# EasyEDA Pro project ProPrj_辉光管_2024.2.16_2024-11-09.epro, board PCB12
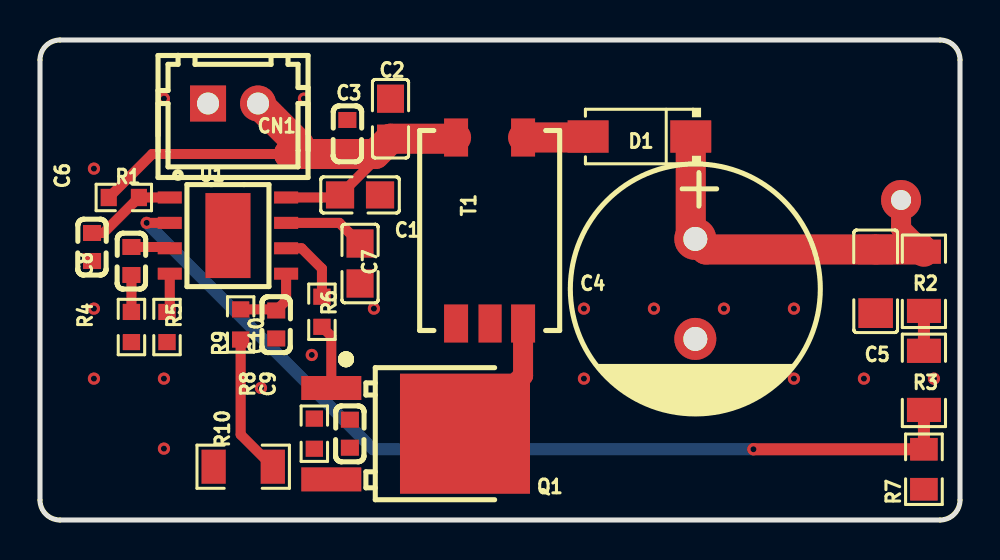
[diagram p6: board, top side]
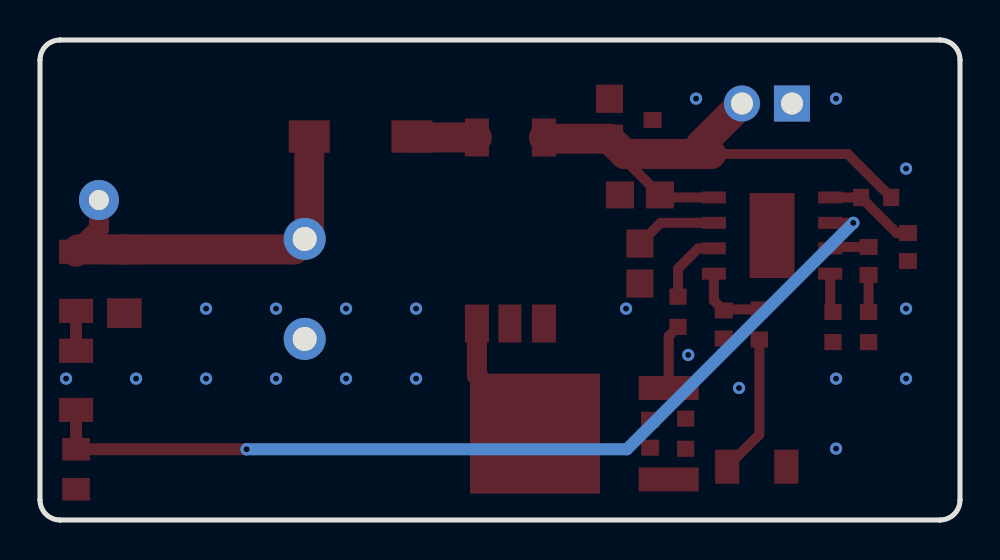
[diagram p7: board, bottom side, seen from below]

Outline 46 x 24 mm; copper layers: Top Layer, Bottom Layer. Coordinates in mm from the lower left corner of the outline.
Outline path: 0,23 0,1 arc(0.29,0.29) 1,0 45,0 arc(45.71,0.29) 46,1 46,23 arc(45.71,23.71) 45,24 1,24 arc(0.29,23.71) 0,23
Stack: Top Layer 0.035mm / Dielectric1 1.51mm FR4 er 4.5 / Bottom Layer 0.035mm

## Design rules (mm)
template: 自定义配置
spacing copperThickness1oz (default): track to track 0.102, other pairs 0.152 to 0.3
spacing copperThickness2oz: track to track 0.203, other pairs 0.152 to 0.3
track width copperThickness1oz (default): min 0.127, default 0.254, max 2.54
track width copperThickness2oz: min 0.203, default 0.254, max 2.54
differential pair differentialPair (default): width min 0.127, default 0.254, max 2.54; gap min 0.152, default 0.152
via viaSize (default): diameter min 0.5, default 0.61, max 10; hole min 0.3, default 0.305, max 6.3

## Placement (name value [footprint] x y rotation side)
C1  10uF  [C0805]  16 16.25 180 top
C2  10uF  [C0805]  17.53 20.06 270 top
C3  100nF  [C0603]  15.37 19.3 270 top
C4  47uF  [CAP-TH_BD12.5-P5.00-D0.6-FD]  32.77 11.55 270 top
C5  100nF  [C1206]  41.78 11.94 90 top
C6  100nF  [C0603]  2.6 13.65 90 top
C7  10uF  [C0805]  16 12.82 270 top
C8  10nF  [C0603]  4.57 12.95 90 top
C9  1nF  [C0603]  15.49 4.31 90 top
C10  100nF  [C0603]  11.81 9.78 90 top
CN1  ZX-XH2.54-2PZZ  [CONN-TH_2P-P2.50_HX25003-2A]  9.65 20.83 0 top
D1  ES1J  [SMA_L4.4-W2.8-LS5.4-RD]  29.97 19.17 180 top
NOREF  -  [Pad_e353]  43.05 16 0 top
Q1  NCEP02515K  [TO-252-3_L6.6-W6.1-P4.58-LS10.1-BR-2]  17.91 4.31 180 top
R1  10kΩ  [R0603]  4.19 16.13 180 top
R2  100kΩ  [R1206]  44.2 11.94 270 top
R3  100kΩ  [R1206]  44.2 6.98 270 top
R4  10kΩ  [R0603]  4.57 9.65 90 top
R5  100kΩ  [R0603]  6.35 9.65 90 top
R6  10Ω  [R0603]  14.1 10.41 270 top
R7  1.5kΩ  [R0805]  44.2 2.54 90 top
R8  10kΩ  [R0603]  13.72 4.31 90 top
R9  20Ω  [R0603]  10.03 9.78 270 top
R10  100mΩ  [R1206]  10.16 2.66 0 top
T1  TTRN-060S-013-T  [TTRN-060S-013]  22.48 14.47 0 top
U1  -  [ESOP-8_L4.9-W3.9-P1.27-LS6.0-BL-EP4.2]  9.4 14.22 270 top

## Footprints (pads in the part's own frame, mm; a bottom-side part is the same pattern mirrored in y, then rotated)
C0603
  rect 0.8x0.9 smd: 1(-0.7,0) 2(0.7,0)
C0805
  rect 1.41x1.35 smd: 1(-1,0) 2(1,0)
C1206
  rect 1.485x1.728 smd: 1(-1.593,0) 2(1.593,0)
CAP-TH_BD12.5-P5.00-D0.6-FD
  round 2.1 hole 1.2: 1(-2.5,0) 2(2.5,0)
CONN-TH_2P-P2.50_HX25003-2A
  rect 1.8x1.8 hole 1.1: 1(-1.25,0)
  round 1.8 hole 1.1: 2(1.25,0)
ESOP-8_L4.9-W3.9-P1.27-LS6.0-BL-EP4.2
  rect 0.6x1.2 smd: 1(-1.905,-2.909) 2(-0.635,-2.909) 3(0.635,-2.909) 4(1.905,-2.909) 5(1.905,2.909) 6(0.635,2.909) 7(-0.635,2.909) 8(-1.905,2.909)
  rect 4.25x2.25 smd: 9(0,0)
Pad_e353
  round 2 hole 1: 1(0,0)
R0603
  rect 0.806x0.864 smd: 1(-0.753,0) 2(0.753,0)
R0805
  rect 1.133x1.377 smd: 1(-1,0) 2(1,0)
R1206
  rect 1.208x1.701 smd: 1(-1.479,0) 2(1.479,0)
SMA_L4.4-W2.8-LS5.4-RD
  rect 2.046x1.62 smd: 1(-2.566,0) 2(2.566,0)
TO-252-3_L6.6-W6.1-P4.58-LS10.1-BR-2
  rect 3x1.2 smd: 1(3.342,-2.285) 3(3.342,2.285)
  rect 6.5x6 smd: 2(-3.342,0)
TTRN-060S-013
  rect 1.2x1.9 smd: 1(-1.675,4.65) 2(1.675,4.651) 3(-1.675,-4.65) 5(1.675,-4.651)
  rect 1.15x1.9 smd: EMPTY(0.025,-4.65)

## Nets
GND: C1.1 C2.1 C3.1 C4.2 C5.1 C6.1 C7.2 C10.1 CN1.1 R4.1 R5.1 R7.1 R10.1 T1.3 U1.9
VIN: C1.2 C2.2 C3.2 CN1.2 R1.2 T1.1 U1.8
FB: R3.2 R7.2 U1.2
HV: C4.1 C5.2 D1.1 NOREF.1 R2.1
$1N1088: C6.2 R1.1 U1.1
$1N1091: C8.2 U1.3
$1N1092: C8.1 R4.2
$1N1093: R5.2 U1.4
$1N1095: C7.1 U1.7
$1N1102: C10.2 R9.1 U1.5
$1N1104: R6.1 U1.6
$1N1105: C9.2 Q1.1 R6.2 R8.2
$1N1106: R2.2 R3.1
$1N1108: C9.1 Q1.3 R8.1 R9.2 R10.2
$1N2253: D1.2 T1.2
$1N2342: Q1.2 T1.5

Pads without a net: T1 EMPTY

## Via types
v1: diameter 0.61, hole 0.304, Top Layer to Bottom Layer, 20 vias
v2: diameter 0.61, hole 0.305, Top Layer to Bottom Layer, 2 vias

## Routing (per net, layer and track width the routed paths; a pad name or vN(x,y) marks a point on that pad's centre or on a via; arc(x,y) is an arc through that point)
GND:
  vias: v1(2.7,17.57) v1(2.7,10.57) v1(2.7,7.07) v1(6.2,21.07) v1(6.2,7.07) v1(6.2,3.57) v1(11.05,6.6) v1(13.2,21.07) v1(13.59,8.25) v1(16.7,10.57) v1(27.2,10.57) v1(27.2,7.07) v1(30.7,10.57) v1(30.7,7.07) v1(34.2,10.57) v1(34.2,7.07) v1(37.7,10.57) v1(37.7,7.07) v1(41.2,7.07) v1(44.7,7.07)
VIN: length 27.7
  Top Layer w0.5: U1.8 14.88,16.13 C1.2 16.76,18.02 16.76,18.3 ; 12.45,18.3 5.61,18.3 R1.2
  Top Layer w1.5: T1.1 20.74,19.06 C2.2 16.76,18.3 12.45,18.3 12.94,18.79 CN1.2
FB: length 46.7
  Top Layer w0.5: U1.2 v2(5.33,14.86)
  Top Layer w0.6: v2(35.67,3.54) R7.2 R3.2
  Bottom Layer w0.6: v2(5.33,14.86) 16.65,3.54 v2(35.67,3.54)
HV: length 19.8
  Top Layer w1: NOREF.1 43.05,14.56 44.08,13.53
  Top Layer w1.5: D1.1 32.54,14.28 C4.1 33.29,13.53 C5.2 44.08,13.53 R2.1
$1N1088: length 4.6
  Top Layer w0.5: U1.1 R1.1 3.17,14.35 C6.2
$1N1091: length 1.9
  Top Layer w0.5: U1.3 6.42,13.65 C8.2
$1N1092: length 1.8
  Top Layer w0.5: 4.57,12.25 R4.2
$1N1093: length 2
  Top Layer w0.5: U1.4 6.49,10.54 R5.2
$1N1095: length 4.1
  Top Layer w0.5: C7.1 14.97,14.86 U1.7
$1N1102: length 3.8
  Top Layer w0.5: R9.1 11.76,10.53 C10.2 12.31,10.97 U1.5
$1N1104: length 3.6
  Top Layer w0.5: R6.1 14.1,12.57 13.08,13.59 U1.6
$1N1105: length 3.3
  Top Layer w0.5: Q1.1 14.56,9.19 R6.2
$1N1106: length 2
  Top Layer w0.6: R2.2 R3.1
$1N1108: length 7
  Top Layer w0.5: R10.2 10.03,4.27 R9.2
$1N2253: length 3.3
  Top Layer w1.5: T1.2 27.36,19.13 D1.2
$1N2342: length 6.7
  Top Layer w1: Q1.2 24.15,7.22 T1.5

## Copper pours and planes (outline as drawn; the poured copper is in the pictures)
GND on Top Layer: 18.54,12.03 19.34,11.24 45.4,11.24 49.02,7.62 55.5,7.62 58.04,5.08 58.04,-3.05 57.66,-3.43 -10.29,-3.43 -11.3,-2.42 -11.3,26.92 -10.92,27.3 -8.64,25.02 16.38,25.02 18.54,22.86
GND on Bottom Layer: 18.54,12.03 19.34,11.24 45.4,11.24 49.02,7.62 55.5,7.62 58.04,5.08 58.04,-3.05 57.66,-3.43 -10.29,-3.43 -11.3,-2.42 -11.3,26.92 -10.92,27.3 -8.64,25.02 16.38,25.02 18.54,22.86
$1N1105 on Top Layer: 12.83,7.36 16.49,7.36 16.49,4.66 12.83,4.66
$1N1108 on Top Layer: 10.92,4.19 16.13,4.19 16.13,1.14 10.92,1.14
